# Altium schematic sheet E17-12-VCU.SchDoc
size A
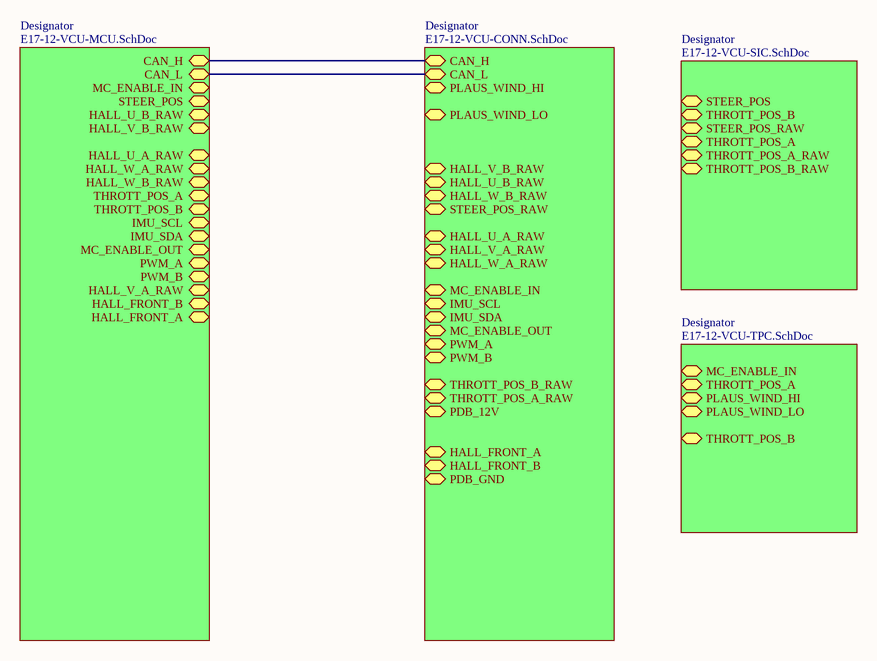
[diagram p0: E17-12-VCU.SchDoc]

## Sub-sheets
Designator = E17-12-VCU-MCU.SchDoc: CAN_L, MC_ENABLE_IN, STEER_POS, HALL_U_B_RAW, HALL_V_B_RAW, CAN_H, HALL_U_A_RAW, HALL_W_A_RAW, HALL_W_B_RAW, THROTT_POS_A, THROTT_POS_B, IMU_SCL, IMU_SDA, MC_ENABLE_OUT, PWM_A, PWM_B, HALL_V_A_RAW, HALL_FRONT_B, HALL_FRONT_A
Designator = E17-12-VCU-CONN.SchDoc: CAN_L, PLAUS_WIND_HI, CAN_H, PLAUS_WIND_LO, HALL_V_B_RAW, HALL_U_B_RAW, HALL_W_B_RAW, STEER_POS_RAW, HALL_U_A_RAW, HALL_V_A_RAW, HALL_W_A_RAW, MC_ENABLE_IN, IMU_SCL, IMU_SDA, MC_ENABLE_OUT, PWM_A, PWM_B, THROTT_POS_B_RAW, THROTT_POS_A_RAW, PDB_12V, HALL_FRONT_A, HALL_FRONT_B, PDB_GND
Designator = E17-12-VCU-SIC.SchDoc: STEER_POS, THROTT_POS_B, STEER_POS_RAW, THROTT_POS_A, THROTT_POS_A_RAW, THROTT_POS_B_RAW
Designator = E17-12-VCU-TPC.SchDoc: MC_ENABLE_IN, THROTT_POS_A, PLAUS_WIND_HI, PLAUS_WIND_LO, THROTT_POS_B

## Nets
(unnamed): sheet Designator/CAN_L, sheet Designator/CAN_L
(unnamed): sheet Designator/CAN_H, sheet Designator/CAN_H